# Altium schematic sheet mcu.SchDoc
size A3
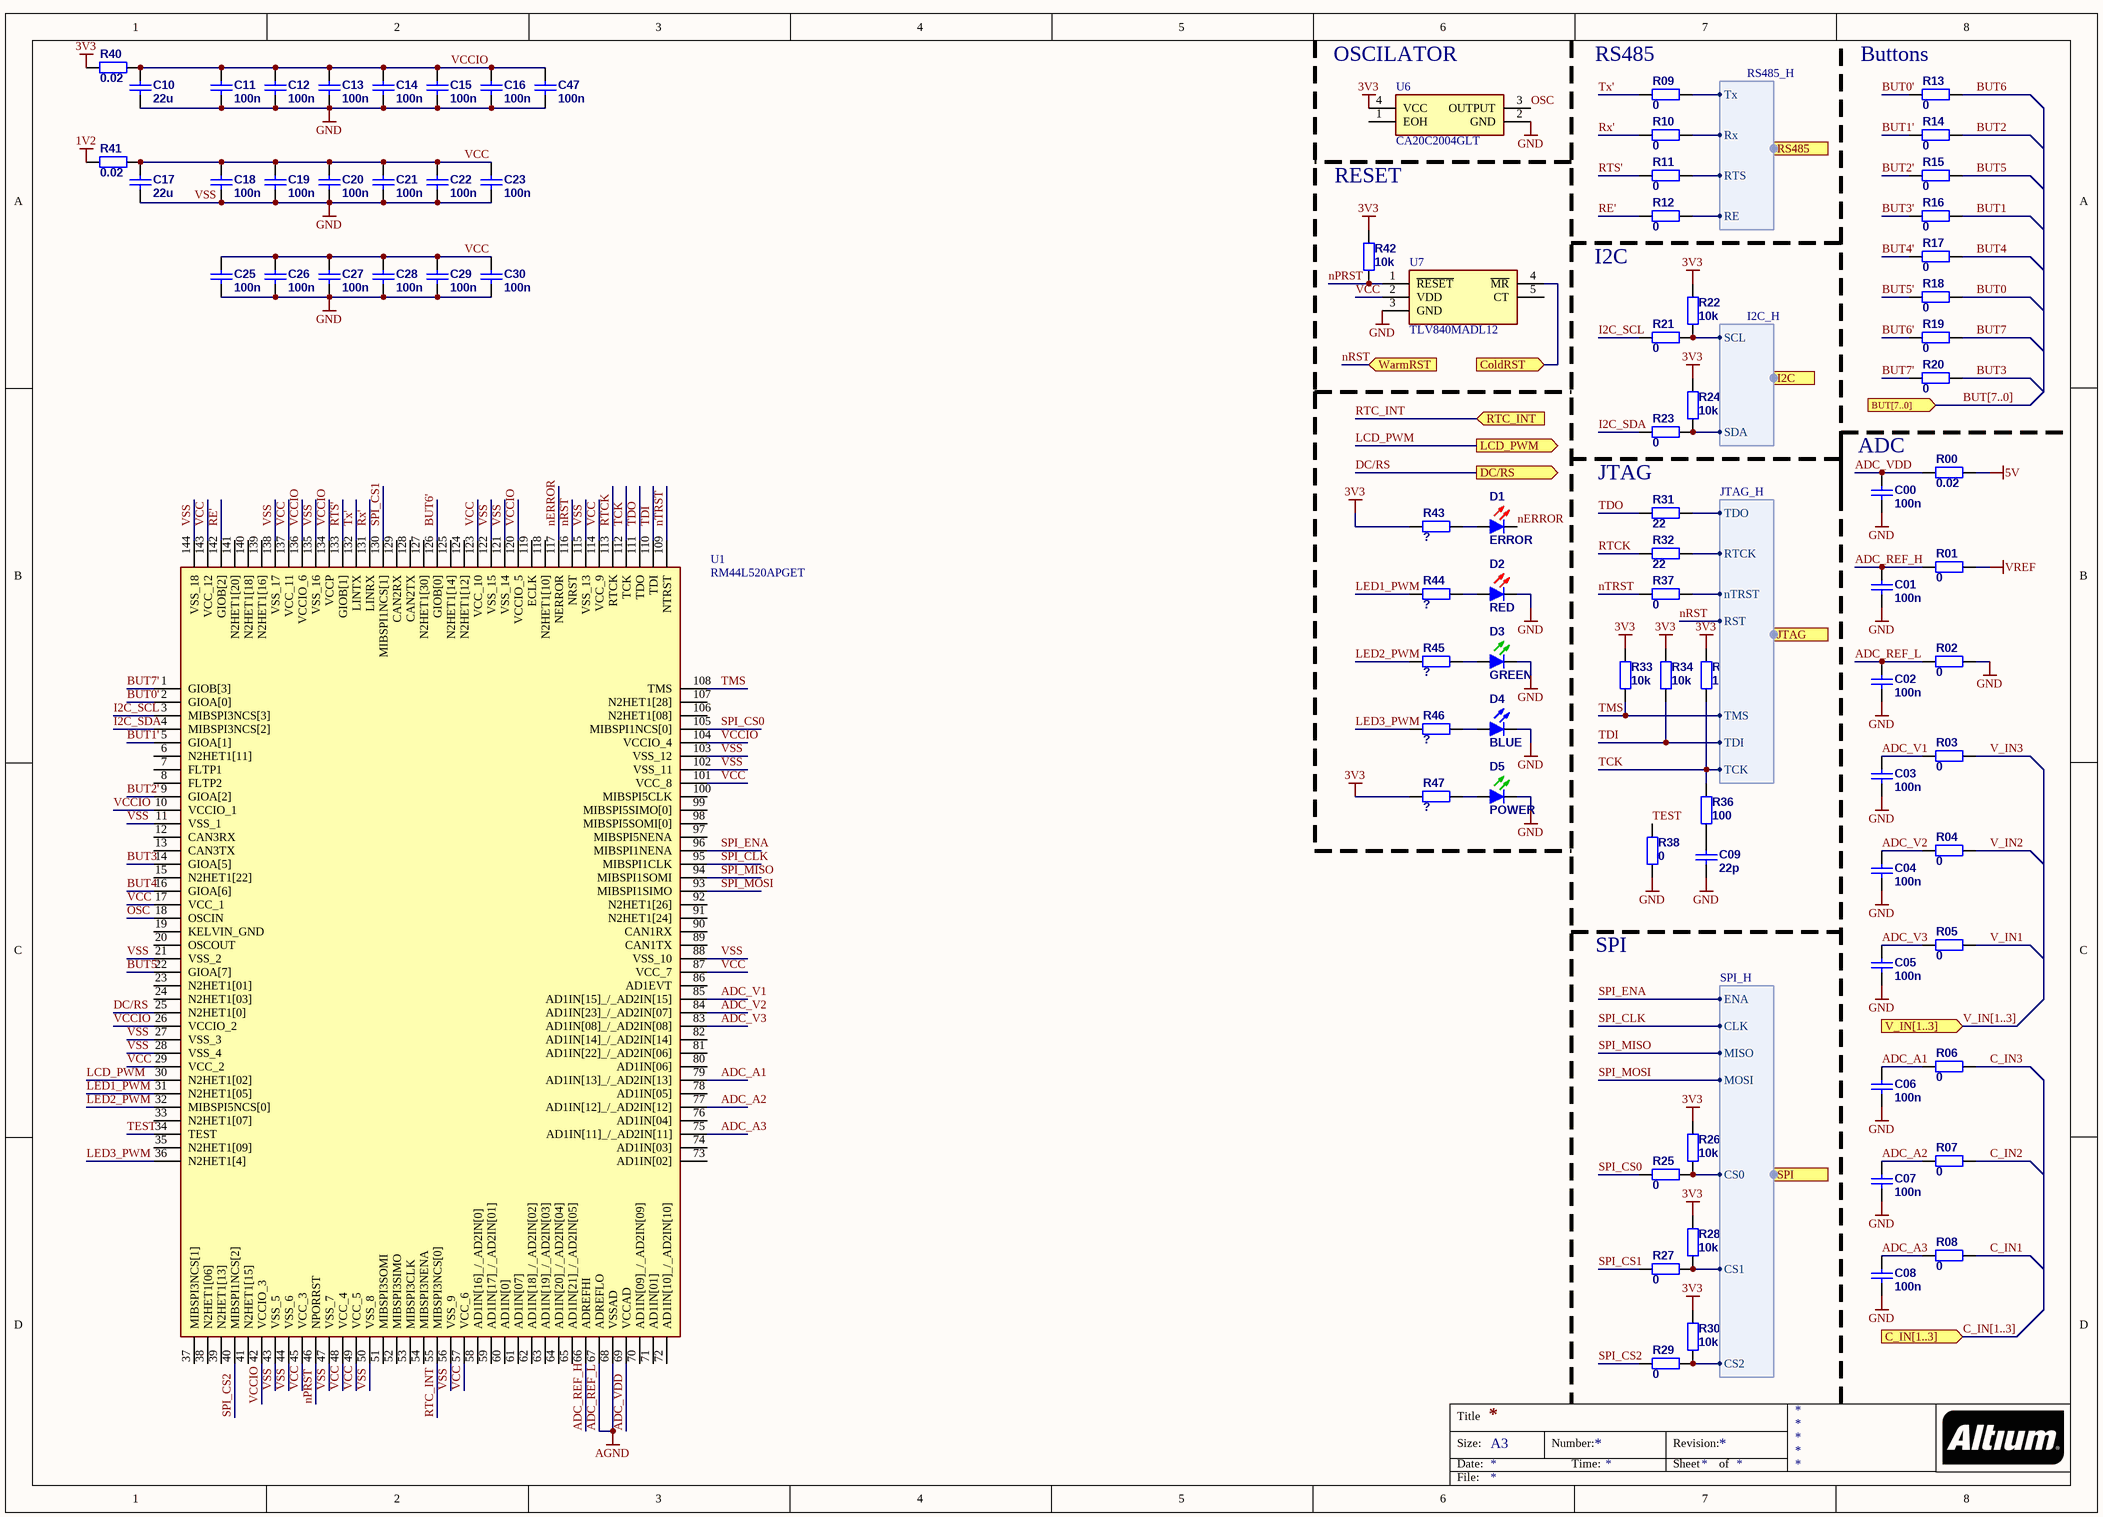
[diagram p0: mcu.SchDoc]

## Parts
C00  100n  [C0402]
C01  100n  [C0402]
C02  100n  [C0402]
C03  100n  [C0402]
C04  100n  [C0402]
C05  100n  [C0402]
C06  100n  [C0402]
C07  100n  [C0402]
C08  100n  [C0402]
C09  22p  [C0402]
C10  22u  [C0603]
C11  100n  [C0402]
C12  100n  [C0402]
C13  100n  [C0402]
C14  100n  [C0402]
C15  100n  [C0402]
C16  100n  [C0402]
C17  22u  [C0603]
C18  100n  [C0402]
C19  100n  [C0402]
C20  100n  [C0402]
C21  100n  [C0402]
C22  100n  [C0402]
C23  100n  [C0402]
C25  100n  [C0402]
C26  100n  [C0402]
C27  100n  [C0402]
C28  100n  [C0402]
C29  100n  [C0402]
C30  100n  [C0402]
C47  100n  [C0402]
D1  ERROR  [LED1206R]
D2  RED  [LED1206R]
D3  GREEN  [LED1206G]
D4  BLUE  [LED1206B]
D5  POWER  [LED1206G]
R00  0.02  [R0402]
R01  0  [R0402]
R02  0  [R0402]
R03  0  [R0402]
R04  0  [R0402]
R05  0  [R0402]
R06  0  [R0402]
R07  0  [R0402]
R08  0  [R0402]
R09  0  [R0402]
R10  0  [R0402]
R11  0  [R0402]
R12  0  [R0402]
R13  0  [R0402]
R14  0  [R0402]
R15  0  [R0402]
R16  0  [R0402]
R17  0  [R0402]
R18  0  [R0402]
R19  0  [R0402]
R20  0  [R0402]
R21  0  [R0402]
R22  10k  [R0402]
R23  0  [R0402]
R24  10k  [R0402]
R25  0  [R0402]
R26  10k  [R0402]
R27  0  [R0402]
R28  10k  [R0402]
R29  0  [R0402]
R30  10k  [R0402]
R31  22  [R0402]
R32  22  [R0402]
R33  10k  [R0402]
R34  10k  [R0402]
R35  10k  [R0402]
R36  100  [R0402]
R37  0  [R0402]
R38  0  [R0402]
R40  0.02  [R0603]
R41  0.02  [R0603]
R42  10k  [R0402]
R43  ?  [R0603]
R44  ?  [R0402]
R45  ?  [R0402]
R46  ?  [R0402]
R47  ?  [R0603]
U1  RM44L520APGET  [QFP50P2200X2200X160-144N]
U6  CA20C2004GLT  [CA20C2004GLT]
U7  TLV840MADL12  [SOT95P280X145-5N]

## Ports
BUT[7..0] (in), C_IN[1..3] (in), ColdRST (in), DC/RS (out), I2C (in, harness I2C_H), JTAG (in, harness JTAG_H), LCD_PWM (out), RS485 (in, harness RS485_H), RTC_INT (in), SPI (in, harness SPI_H), V_IN[1..3] (in), WarmRST (in)

## Harnesses
RS485_H: Tx, Rx, RTS, RE
I2C_H: SCL, SDA
JTAG_H: TDO, RTCK, nTRST, TMS, TCK, TDI, RST
SPI_H: ENA, CLK, MISO, MOSI, CS0, CS1, CS2

## Nets
1V2: R41.1
3V3: R22.2 R24.1 R26.2 R28.2 R30.1 R33.2 R34.2 R35.2 R40.1 R42.2 R43.2 R47.2 U6.4(VCC)
5V: R00.2
ADC_REF_L: C02.2 R02.1 U1.67(ADREFLO) U1.68(VSSAD)  [also labelled AGND]
VREF: R01.2
VSS: C00.1 C01.1 C02.1 C03.1 C04.1 C05.1 C06.1 C07.1 C08.1 C09.1 C10.1 C11.1 C12.1 C13.1 C14.1 C15.1 C16.1 C17.1 C18.1 C19.1 C20.1 C21.1 C22.1 C23.1 C25.1 C26.1 C27.1 C28.1 C29.1 C30.1 C47.1 D2.2(K) D3.2(K) D4.2(K) D5.2(K) R02.2 R38.1 U1.11(VSS_1) U1.21(VSS_2) U1.27(VSS_3) U1.28(VSS_4) U1.43(VSS_5) U1.44(VSS_6) U1.47(VSS_7) U1.50(VSS_8) U1.56(VSS_9) U1.88(VSS_10) U1.102(VSS_11) U1.103(VSS_12) U1.115(VSS_13) U1.121(VSS_14) U1.122(VSS_15) U1.135(VSS_16) U1.138(VSS_17) U1.144(VSS_18) U6.2(GND) U7.3(GND)  [also labelled GND]
ADC_A1: C06.2 R06.1 U1.79(AD1IN[13]_/_AD2IN[13])
ADC_A2: C07.2 R07.1 U1.77(AD1IN[12]_/_AD2IN[12])
ADC_A3: C08.2 R08.1 U1.75(AD1IN[11]_/_AD2IN[11])
ADC_REF_H: C01.2 R01.1 U1.66(ADREFHI)
ADC_V1: C03.2 R03.1 U1.85(AD1IN[15]_/_AD2IN[15])
ADC_V2: C04.2 R04.1 U1.84(AD1IN[23]_/_AD2IN[07])
ADC_V3: C05.2 R05.1 U1.83(AD1IN[08]_/_AD2IN[08])
ADC_VDD: C00.2 R00.1 U1.69(VCCAD)
BUT0: R18.2
BUT0': R13.1 U1.2(GIOA[0])
BUT1: R16.2
BUT1': R14.1 U1.5(GIOA[1])
BUT2: R14.2
BUT2': R15.1 U1.9(GIOA[2])
BUT3: R20.2
BUT3': R16.1 U1.14(GIOA[5])
BUT4: R17.2
BUT4': R17.1 U1.16(GIOA[6])
BUT5: R15.2
BUT5': R18.1 U1.22(GIOA[7])
BUT6: R13.2
BUT6': R19.1 U1.126(GIOB[0])
BUT7: R19.2
BUT7': R20.1 U1.1(GIOB[3])
C_IN1: R08.2
C_IN2: R07.2
C_IN3: R06.2
ColdRST: U7.4(~{MR}) ; port ColdRST
DC/RS: U1.25(N2HET1[0]) ; port DC/RS
I2C_SCL: R21.1 U1.3(MIBSPI3NCS[3])
I2C_SDA: R23.2 U1.4(MIBSPI3NCS[2])
LCD_PWM: U1.30(N2HET1[02]) ; port LCD_PWM
LED1_PWM: R44.2 U1.31(N2HET1[05])
LED2_PWM: R45.2 U1.32(MIBSPI5NCS[0])
LED3_PWM: R46.2 U1.36(N2HET1[4])
nERROR: D1.2(K) U1.117(NERROR)
nPRST: R42.1 U1.46(NPORRST) U7.1(~{RESET})
nRST: U1.116(NRST) ; port WarmRST, port JTAG.RST
nTRST: R37.1 U1.109(NTRST)
OSC: U1.18(OSCIN) U6.3(OUTPUT)
RE': R12.1 U1.142(GIOB[2])
RTC_INT: U1.55(MIBSPI3NCS[0]) ; port RTC_INT
RTCK: R32.1 U1.113(RTCK)
RTS': R11.1 U1.133(GIOB[1])
Rx': R10.1 U1.131(LINRX)
SPI_CLK: U1.95(MIBSPI1CLK) ; port SPI.CLK
SPI_CS0: R25.1 U1.105(MIBSPI1NCS[0])
SPI_CS1: R27.2 U1.130(MIBSPI1NCS[1])
SPI_CS2: R29.2 U1.40(MIBSPI1NCS[2])
SPI_ENA: U1.96(MIBSPI1NENA) ; port SPI.ENA
SPI_MISO: U1.94(MIBSPI1SOMI) ; port SPI.MISO
SPI_MOSI: U1.93(MIBSPI1SIMO) ; port SPI.MOSI
TCK: R35.1 R36.2 U1.112(TCK) ; port JTAG.TCK
TDI: R34.1 U1.110(TDI) ; port JTAG.TDI
TDO: R31.1 U1.111(TDO)
TEST: R38.2 U1.34(TEST)
TMS: R33.1 U1.108(TMS) ; port JTAG.TMS
Tx': R09.1 U1.132(LINTX)
V_IN1: R05.2
V_IN2: R04.2
V_IN3: R03.2
VCC: C17.2 C18.2 C19.2 C20.2 C21.2 C22.2 C23.2 C25.2 C26.2 C27.2 C28.2 C29.2 C30.2 R41.2 U1.17(VCC_1) U1.29(VCC_2) U1.45(VCC_3) U1.48(VCC_4) U1.49(VCC_5) U1.57(VCC_6) U1.87(VCC_7) U1.101(VCC_8) U1.114(VCC_9) U1.123(VCC_10) U1.137(VCC_11) U1.143(VCC_12) U7.2(VDD)
VCCIO: C10.2 C11.2 C12.2 C13.2 C14.2 C15.2 C16.2 C47.2 R40.2 U1.10(VCCIO_1) U1.26(VCCIO_2) U1.42(VCCIO_3) U1.104(VCCIO_4) U1.120(VCCIO_5) U1.134(VCCP) U1.136(VCCIO_6)
NetC09_2: C09.2 R36.1
NetD1_1: D1.1(A) R43.1
NetD2_1: D2.1(A) R44.1
NetD3_1: D3.1(A) R45.1
NetD4_1: D4.1(A) R46.1
NetD5_1: D5.1(A) R47.1
NetR09_2: R09.2 ; port RS485.Tx
NetR10_2: R10.2 ; port RS485.Rx
NetR11_2: R11.2 ; port RS485.RTS
NetR12_2: R12.2 ; port RS485.RE
NetR21_2: R21.2 R22.1 ; port I2C.SCL
NetR23_1: R23.1 R24.2 ; port I2C.SDA
NetR25_2: R25.2 R26.1 ; port SPI.CS0
NetR27_1: R27.1 R28.1 ; port SPI.CS1
NetR29_1: R29.1 R30.2 ; port SPI.CS2
NetR31_2: R31.2 ; port JTAG.TDO
NetR32_2: R32.2 ; port JTAG.RTCK
NetR37_2: R37.2 ; port JTAG.nTRST

Not connected (* = marked no-connect by the designer): U1 6(N2HET1[11]) 7(FLTP1) 8(FLTP2) 12(CAN3RX) 13(CAN3TX) 15(N2HET1[22]) 19(KELVIN_GND) 20(OSCOUT) 23(N2HET1[01]) 24(N2HET1[03]) 33(N2HET1[07]) 35(N2HET1[09]) 37(MIBSPI3NCS[1]) 38(N2HET1[06]) 39(N2HET1[13]) 41(N2HET1[15]) 51(MIBSPI3SOMI) 52(MIBSPI3SIMO) 53(MIBSPI3CLK) 54(MIBSPI3NENA) 58(AD1IN[16]_/_AD2IN[0]) 59(AD1IN[17]_/_AD2IN[01]) 60(AD1IN[0]) 61(AD1IN[07]) 62(AD1IN[18]_/_AD2IN[02]) 63(AD1IN[19]_/_AD2IN[03]) 64(AD1IN[20]_/_AD2IN[04]) 65(AD1IN[21]_/_AD2IN[05]) 70(AD1IN[09]_/_AD2IN[09]) 71(AD1IN[01]) 72(AD1IN[10]_/_AD2IN[10]) 73(AD1IN[02]) 74(AD1IN[03]) 76(AD1IN[04]) 78(AD1IN[05]) 80(AD1IN[06]) 81(AD1IN[22]_/_AD2IN[06]) 82(AD1IN[14]_/_AD2IN[14]) 86(AD1EVT) 89(CAN1TX) 90(CAN1RX) 91(N2HET1[24]) 92(N2HET1[26]) 97(MIBSPI5NENA) 98(MIBSPI5SOMI[0]) 99(MIBSPI5SIMO[0]) 100(MIBSPI5CLK) 106(N2HET1[08]) 107(N2HET1[28]) 118(N2HET1[10]) 119(ECLK) 124(N2HET1[12]) 125(N2HET1[14]) 127(N2HET1[30]) 128(CAN2TX) 129(CAN2RX) 139(N2HET1[16]) 140(N2HET1[18]) 141(N2HET1[20]); U6 1(EOH); U7 5(CT)

## Buses and harness runs
bus BUT[7..0] = port BUT[7..0]
bus C_IN[1..3] = port C_IN[1..3]
bus V_IN[1..3] = port V_IN[1..3]

## Notes on the sheet
- (near U6) OSCILATOR
- (near R09) RS485
- (near R13) Buttons
- RESET
- (near R12) I2C
- ADC
- JTAG
- SPI
- Title
- Size:
- Date:
- A3
- Number:
- Time:
- Revision:
- Sheet
- of
- File:

## Library data of the parts
C00 C01 C02 C03 C04 C05 C06 C07 C08 C09-C23 C25-C30 C47 = Cap: Capacitor; ComponentLink1Description: datasheet; ComponentLink2Description: supplier
  C00 C01 C02 C03 C04 C05 C06 C07 C08 C11-C16 C18-C23 C25-C30 C47: Value: 100n
  C09: Value: 22p
  C10 C17: Value: 22u
D1 D2 = LED_RED: RED LED; Published: 04-Apr-2006
D3 D5 = LED_GREEN: GREEN LED; Published: 04-Apr-2006
D4 = LED_BLUE: BLUE LED; Published: 04-Apr-2006
R00 R01 R02 R03 R04 R05 R06 R07 R08 R09-R38 R40-R47 = Res: Resistor; Published: 19-Feb-2006; ComponentLink1Description: datasheet; ComponentLink2Description: supplier
  R00 R40 R41: Value: 0.02
  R01 R02 R03 R04 R05 R06 R07 R08 R09-R21 R23 R25 R27 R29 R37 R38: Value: 0
  R22 R24 R26 R28 R30 R33-R35 R42: Value: 10k
  R31 R32: Value: 22
  R36: Value: 100
  R43-R47: Value: ?
U1 = RM44L520APGET: Integrated Circuit; Manufacturer_Name: Texas Instruments; Datasheet Link: http://www.ti.com/lit/gpn/rm44l520; Height: 1.6mm; Mouser2 Part Number: 595-RM44L520APGET; Mouser2 Price/Stock: https://www.mouser.com/Search/Refine.aspx?Keyword=595-RM44L520APGET; Manufacturer_Part_Number: RM44L520APGET
U6 = CA20C2004GLT: Crystal or Oscillator; Manufacturer_Name: CTS; Datasheet Link: https://componentsearchengine.com//CA20C2004GLT.pdf; Height: 0.8mm; Mouser2 Part Number: 774-CA20C2004GLT; Mouser2 Price/Stock: https://www.mouser.com/Search/Refine.aspx?Keyword=774-CA20C2004GLT; Manufacturer_Part_Number: CA20C2004GLT
U7 = TLV840MAPL36DBVRQ1: Integrated Circuit; Manufacturer_Name: Texas Instruments; Datasheet Link: https://www.ti.com/lit/gpn/TLV840-Q1; Height: 1.45mm; Manufacturer_Part_Number: TLV840MAPL36DBVRQ1